# EAGLE schematic dc-motor-driver (EAGLE 4.16)
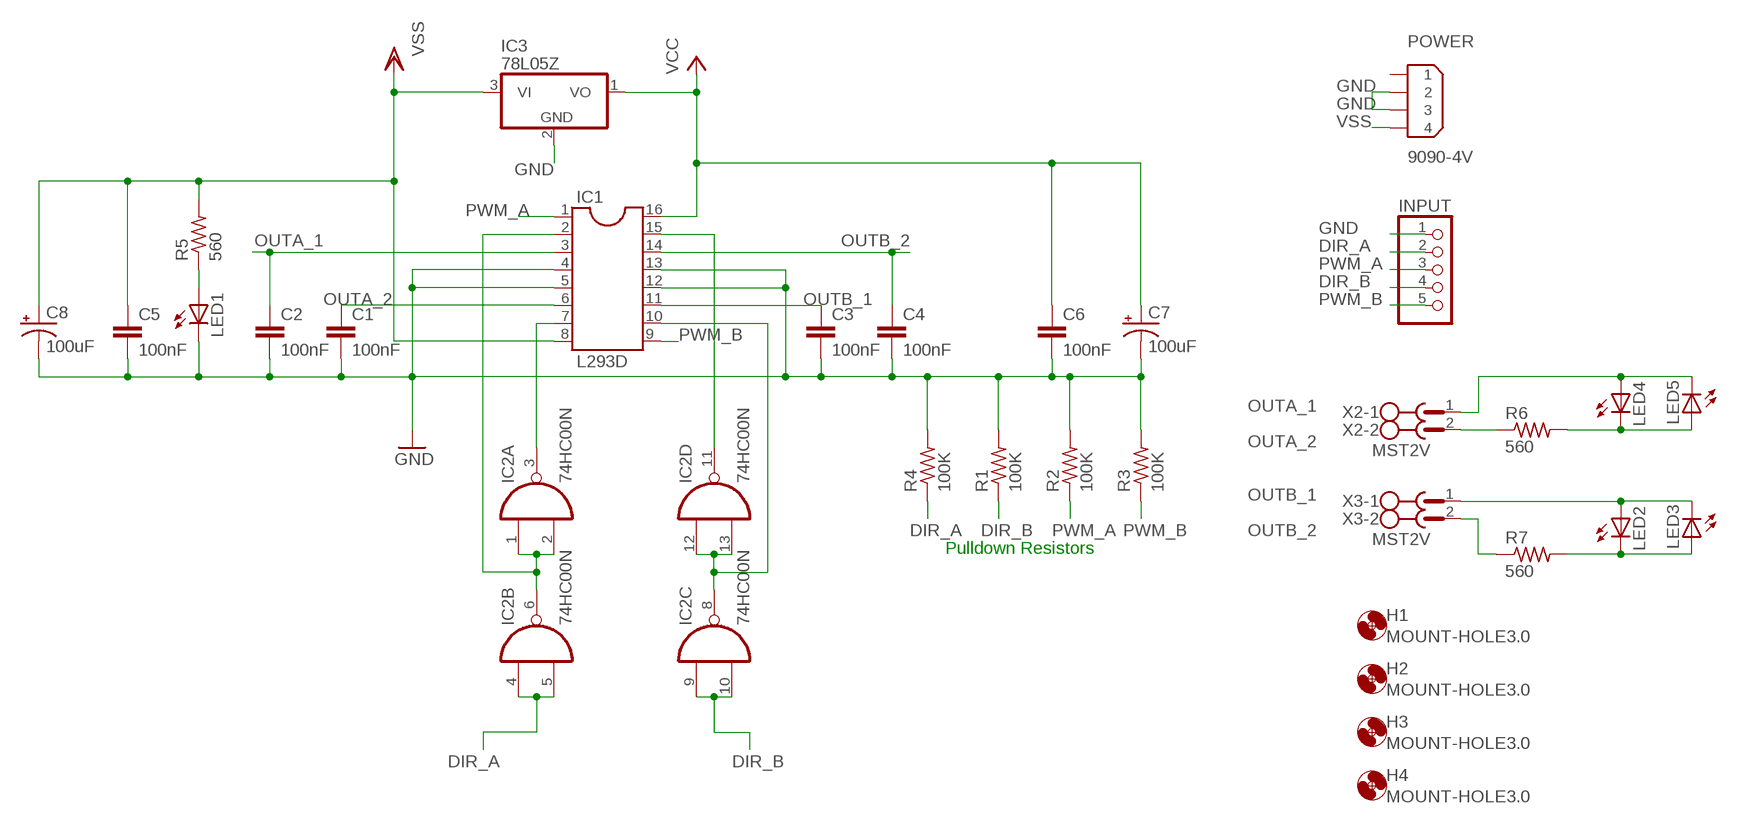
[diagram p0: schematic, sheet 1]

## Parts
C1  100nF  C-EU050-035X075  [C050-035X075]
C2  100nF  C-EU050-035X075  [C050-035X075]
C3  100nF  C-EU050-035X075  [C050-035X075]
C4  100nF  C-EU050-035X075  [C050-035X075]
C5  100nF  C-EU050-035X075  [C050-035X075]
C6  100nF  C-EU050-035X075  [C050-035X075]
C7  100uF  CPOL-USE3.5-8  [E3,5-8]
C8  100uF  CPOL-USE3.5-8  [E3,5-8]
H1  MOUNT-HOLE3.0  [3,0]
H2  MOUNT-HOLE3.0  [3,0]
H3  MOUNT-HOLE3.0  [3,0]
H4  MOUNT-HOLE3.0  [3,0]
IC1  L293D  DIL16S  [SOCKED-16]
IC2  74HC00N  [DIL14]
IC3  78L05Z  [TO92]
INPUT  PINHD-1X5  [1X05]
LED1  LED5MM  [LED5MM]
LED2  LED5MM  [LED5MM]
LED3  LED5MM  [LED5MM]
LED4  LED5MM  [LED5MM]
LED5  LED5MM  [LED5MM]
POWER  9090-4V  [9090-4V]
R1  100K  R-US_0207/7  [0207/7]
R2  100K  R-US_0207/7  [0207/7]
R3  100K  R-US_0207/7  [0207/7]
R4  100K  R-US_0207/7  [0207/7]
R5  560  R-US_0207/7  [0207/7]
R6  560  R-US_0207/7  [0207/7]
R7  560  R-US_0207/7  [0207/7]
X2  MST2V  [MSTBV2]
X3  MST2V  [MSTBV2]

## Nets
DIR_A: IC2.4(B:I0) IC2.5(B:I1) INPUT.2 R4.1
DIR_B: IC2.9(C:I0) IC2.10(C:I1) INPUT.4 R1.1
GND: C1.2 C2.2 C3.2 C4.2 C5.2 C6.2 C7.- C8.- IC1.4 IC1.5 IC1.12 IC1.13 IC3.2(GND) INPUT.1 LED1.K(C) POWER.2 POWER.3 R1.2 R2.2 R3.2 R4.2
N$1: IC1.7 IC2.3(A:O)
N$2: IC1.2 IC2.1(A:I0) IC2.2(A:I1) IC2.6(B:O)
N$3: IC1.15 IC2.11(D:O)
N$4: IC1.10 IC2.8(C:O) IC2.12(D:I0) IC2.13(D:I1)
N$5: LED1.A R5.1
N$6: LED2.K(C) LED3.A R7.2
N$8: LED4.K(C) LED5.A R6.2
OUTA_1 [power]: C2.1 IC1.3 LED4.A LED5.K(C) X2.1
OUTA_2 [power]: C1.1 IC1.6 R6.1 X2.2
OUTB_1 [power]: C3.1 IC1.11 LED2.A LED3.K(C) X3.1
OUTB_2 [power]: C4.1 IC1.14 R7.1 X3.2
PWM_A: IC1.1 INPUT.3 R2.1
PWM_B: IC1.9 INPUT.5 R3.1
VCC: C6.1 C7.+ IC1.16 IC3.1(VO)
VSS [power]: C5.1 C8.+ IC1.8 IC3.3(VI) POWER.4 R5.2
Unconnected: POWER.1

## Notes on the sheet
- Pulldown Resistors

## Power pins joined to a net without a drawn wire
GND: IC2.7(P:GND)
VCC: IC2.14(P:VCC)

## Library data of the parts
C1-C6 = rcl:C-EU: CAPACITOR, European symbol
C7 C8 = rcl:CPOL-US: POLARIZED CAPACITOR, American symbol
H1-H4 = holes:MOUNT-HOLE: MOUNTING HOLE with drill center marker
IC1 = ic-package:DIL16: Dual In Line
IC2 = 74xx-eu:74*00: Quad 2-input NAND gate
IC3 = linear:78*: Positive VOLTAGE REGULATOR Source: http://cache.national.com/ds/LM/LM78L05.pdf http://www.fairchildsemi.com/ds/LM/LM7805.pdf
INPUT = pinhead:PINHD-1X5: PIN HEADER
LED1-LED5 = led:LED: LED OSRAM: - CHIPLED LG R971, LG N971, LY N971, LG Q971, LY Q971, LO R971, LY R971 LH N974, LH R974 LS Q976, LO Q976, LY Q976 LO Q996 - Hyper CHIPLED LW Q18S LB Q993, LB Q99A, LB R99A - SideLED LS A670, LO A670, LY A670, LG A670, LP A670 LB A673, LV A673, LT A673, LW A673 LH A674 LY A675 LS A676, LA A676, LO A676, LY A676, LW A676 LS A679, LY A679, LG A679 - Hyper Micro SIDELED® LS Y876, LA Y876, LO Y876, LY Y876 LT Y87S - SmartLED LW L88C, LW L88S LB L89C, LB L89S, LG L890 LS L89K, LO L89K, LY L89K LS L896, LA L896, LO L896, LY L896 - TOPLED LS T670, LO T670, LY T670, LG T670, LP T670 LSG T670, LSP T670, LSY T670, LOP T670, LYG T670 LG T671, LOG T671, LSG T671 LB T673, LV T673, LT T673, LW T673 LH T674 LS T676, LA T676, LO T676, LY T676, LB T676, LH T676, LSB T676, LW T676 LB T67C, LV T67C, LT T67C, LS T67K, LO T67K, LY T67K, LW E67C LS E67B, LA E67B, LO E67B, LY E67B, LB E67C, LV E67C, LT E67C LW T67C LS T679, LY T679, LG T679 LS T770, LO T770, LY T770, LG T770, LP T770 LB T773, LV T773, LT T773, LW T773 LH T774 LS E675, LA E675, LY E675, LS T675 LS T776, LA T776, LO T776, LY T776, LB T776 LHGB T686 LT T68C, LB T68C - Hyper Mini TOPLED® LB M676 - Mini TOPLED Santana® LG M470 LS M47K, LO M47K, LY M47K Source: http://www.osram.convergy.de - LUMILED® LXK2-PW12-R00, LXK2-PW12-S00, LXK2-PW14-U00, LXK2-PW14-V00 LXK2-PM12-R00, LXK2-PM12-S00, LXK2-PM14-U00 LXK2-PE12-Q00, LXK2-PE12-R00, LXK2-PE12-S00, LXK2-PE14-T00, LXK2-PE14-U00 LXK2-PB12-K00, LXK2-PB12-L00, LXK2-PB12-M00, LXK2-PB14-N00, LXK2-PB14-P00, LXK2-PB14-Q00 LXK2-PR12-L00, LXK2-PR12-M00, LXK2-PR14-Q00, LXK2-PR14-R00 LXK2-PD12-Q00, LXK2-PD12-R00, LXK2-PD12-S00 LXK2-PH12-R00, LXK2-PH12-S00 LXK2-PL12-P00, LXK2-PL12-Q00, LXK2-PL12-R00 Source: www.luxeon.com
POWER = con-thomas-betts:9090-4: Disk Drive Power four position Source: Thomas & Betts Electronic Interconnects Eiropean Edition 1998
R1-R7 = rcl:R-US_: RESISTOR, American symbol
X2 X3 = con-phoenix-508:MST2V: PHOENIX

## Net classes
0 default: width 0.406 mm, drill 0.635 mm
1 power: width 0.508 mm, drill 0.635 mm